# Altium schematic sheet ui_lo.SchDoc: mcHF Pro Transceiver UI board
size A3; Author: Krassi Atanassov; CompanyName: MØNKA; Engineer: For radio amateurs experimentation, non-commercial use only. Thank you!; Revision: 0.8.5; SheetTotal: 13
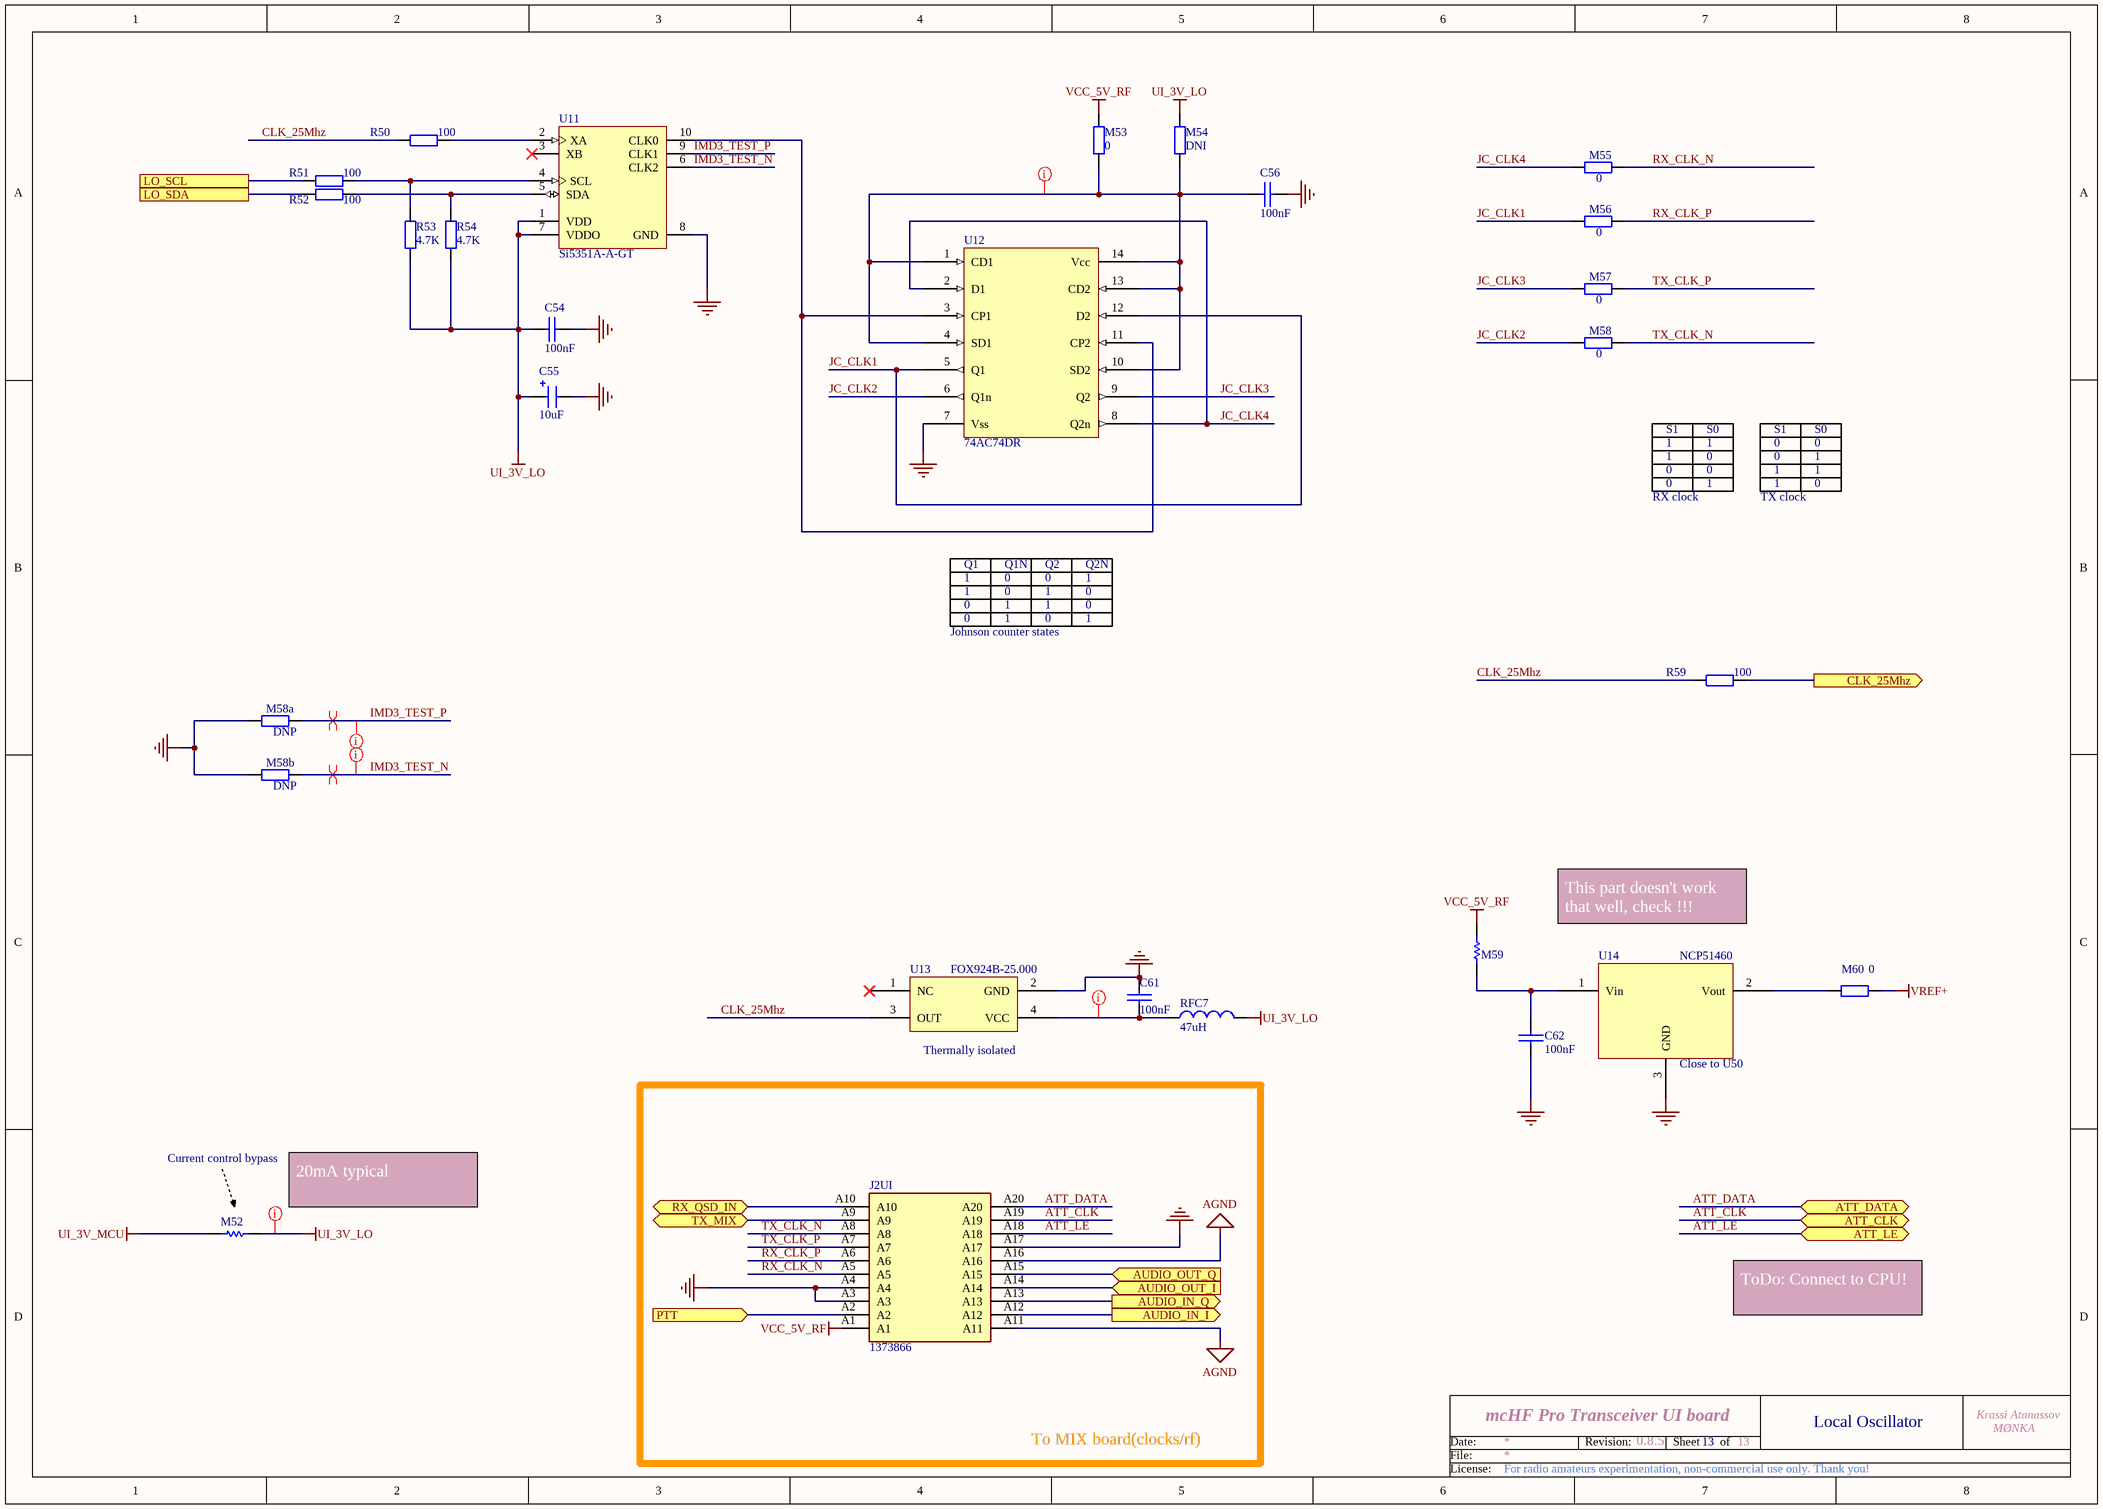
[diagram p0: ui_lo.SchDoc]

## Parts
C54  100nF  [0805]
C55  10uF  [1206_Elec_Cap]
C56  100nF  [0805]
C61  100nF  [0805]
C62  100nF  [0805]
J2UI  1373866  [YuanQi4mm]
M52  0  [SB_0603]  (value not drawn)  (net tie, no BOM)
M53  0  [0805]
M54  DNI  [0805]  (no BOM)
M55  0  [0805]
M56  0  [0805]
M57  0  [0805]
M58  0  [0805]
M58a  DNP  [0805]  (no BOM)
M58b  DNP  [0805]  (no BOM)
M59  0  [SB_0603]  (value not drawn)  (net tie, no BOM)
M60  0  [0805]
R50  100  [0805]
R51  100  [0805]
R52  100  [0805]
R53  4.7K  [0805]
R54  4.7K  [0805]
R59  100  [0805]
RFC7  47uH  [0805]
U11  Si5351A-A-GT  [SLAB-MSOP-10_N]
U12  74AC74DR  [SO-14]
U13  FOX924B-25.000  [2SMX-3SMXB]
U14  NCP51460  [SOT-23]

## Blocks framed on the sheet
To MIX board(clocks/rf): J2UI

## Ports
ATT_CLK (bidir), ATT_DATA (bidir), ATT_LE (bidir), AUDIO_IN_I (out), AUDIO_IN_Q (out), AUDIO_OUT_I (in), AUDIO_OUT_Q (in), CLK_25Mhz (out), LO_SCL, LO_SDA, PTT (in), RX_QSD_IN (bidir), TX_MIX (bidir)

## Nets
AGND: J2UI.A11 J2UI.A16
GND: C54.2 C55.2 C56.1 C61.1 C62.2 J2UI.A3 J2UI.A4 J2UI.A17 M58a.2 M58b.2 U11.8(GND) U12.7(Vss) U13.2(GND) U14.3(GND)
UI_3V_LO: C54.1 C55.1 M52.2 M54.2 R53.2 R54.2 RFC7.2 U11.1(VDD) U11.7(VDDO)
UI_3V_MCU: M52.1
VCC_5V_RF: J2UI.A1 M53.2 M59.2
VREF+: M60.1
ATT_CLK: J2UI.A19 ; port ATT_CLK
ATT_DATA: J2UI.A20 ; port ATT_DATA
ATT_LE: J2UI.A18 ; port ATT_LE
AUDIO_IN_I: J2UI.A12 ; port AUDIO_IN_I
AUDIO_IN_Q: J2UI.A13 ; port AUDIO_IN_Q
AUDIO_OUT_I: J2UI.A14 ; port AUDIO_OUT_I
AUDIO_OUT_Q: J2UI.A15 ; port AUDIO_OUT_Q
CLK_25Mhz: R50.2 R59.2 U13.3(OUT)
CLK_25Mhz: R59.1 ; port CLK_25Mhz  [a separate net that carries the same name]
IMD3_TEST_N: M58b.1 U11.6(CLK2)
IMD3_TEST_P: M58a.1 U11.9(CLK1)
JC_CLK1: M56.2 U12.5(Q1) U12.12(D2)
JC_CLK2: M58.2 U12.6(Q1n)
JC_CLK3: M57.2 U12.9(Q2)
JC_CLK4: M55.2 U12.2(D1) U12.8(Q2n)
LO_SCL: R51.2 ; port LO_SCL
LO_SDA: R52.2 ; port LO_SDA
PTT: J2UI.A2 ; port PTT
RX_CLK_N: J2UI.A5 M55.1
RX_CLK_P: J2UI.A6 M56.1
RX_QSD_IN: J2UI.A10 ; port RX_QSD_IN
TX_CLK_N: J2UI.A8 M58.1
TX_CLK_P: J2UI.A7 M57.1
TX_MIX: J2UI.A9 ; port TX_MIX
NetC56_2: C56.2 M53.1 M54.1 U12.1(CD1) U12.4(SD1) U12.10(SD2) U12.13(CD2) U12.14(Vcc)
NetC61_2: C61.2 RFC7.1 U13.4(VCC)
NetC62_1: C62.1 M59.1 U14.1(Vin)
NetM60_2: M60.2 U14.2(Vout)
NetR50_1: R50.1 U11.2(XA)
NetR51_1: R51.1 R53.1 U11.4(SCL)
NetR52_1: R52.1 R54.1 U11.5(SDA)
NetU11_10: U11.10(CLK0) U12.3(CP1) U12.11(CP2)

Not connected (* = marked no-connect by the designer): U11 3(XB)*; U13 1(NC)*

## Layout directives
rule Width Constraint [Pref Width = 12mil    Min Width = 12mil    Max Width = 12mil]: NetC56_2, NetC61_2, UI_3V_LO
differential pair: IMD3_TEST_N, IMD3_TEST_P
rule Matched Net Lengths [Tolerance = 300mil]: IMD3_TEST_N, IMD3_TEST_P

## Notes on the sheet
- S1
- 1
- S0
- 0
- RX clock
- TX clock
- Q1
- Q1N
- Q2
- Q2N
- Johnson counter states
- This part doesn't work that well, check !!!
- (near U13) Thermally isolated
- (near U14) Close to U50
- Current control bypass
- (near M52) 20mA typical
- ToDo: Connect to CPU!
- 13
- Local Oscillator
- Date:
- File:
- Revision:
- Sheet
- of
- License:

## Library data of the parts
C54 C56 C62 = CAP: Capacitor; Order: FN 252-2090; QT Order: QCC-00154; Price: 0.068
C55 = CAP-POL: Electrolitic capacitor; Order: FN 233-3009; QT Order: QCC-00166; Price: 0.204
C61 = CAP: Capacitor; Order: FN 174-0673; QT Order: QCC-00154; Price: 0.068
J2UI = YQ_20p: SMD male connector, nominal current: 2.2 A, Test voltage: 840 VAC, number of positions: 20, pitch: 1.27 mm, color: black, contact surface: Gold, type of contact: Male connector, mounting: SMD soldering; Manufacturer_Name: Phoenix Contact; Geometry.Height: 6.75mm; Mouser Part Number: 651-1373866; Mouser Price/Stock: https://www.mouser.co.uk/ProductDetail/Phoenix-Contact/1373866?qs=2SLPxufLcgAs0enIXKjUUw%3D%3D; Manufacturer_Part_Number: 1373866; Datasheet Link: http://www.phoenixcontact.com/gb/produkte/1373866
M52 M59 = Link: Value: 1K; Published: 8-Jun-2000; Revision: July-2002: Re-released for DXP Platform.; Publisher: Altium Limited
M53-M58 M58a M58b M60 = RES: Resistor; Order: FN 933-3681; QT Order: QCR-00268; Price: 0.009
R50-R52 R59 = RES: Resistor; Order: FN 933-2375; QT Order: QCR-00301; Price: 0.027
R53 R54 = RES: Resistor; Order: FN 200-8383; QT Order: QCR-00341; Price: 0.024
RFC7 = Inductor: Order: FN 166-9895; Price: 0.16
U11 = Si5351A-A-GT: I2C-Programmable Any-Frequency CMOS Clock Generator + VCXO, 2.5 / 3.3 V, 0.008 to 160 MHz Output, -40 to 85 degC, 10-pin SOP; Manufacturer: Silicon Labs; Output Format: LVCMOS; Reference Inputs: 1; VDD: 2.5 V; 3.3 V; Sub-Family: Clock Generators; Notes: Farnell had it cheap (like 80 pence); DatasheetVersion: Rev. 0.95; PackageReference: MSOP-10; PackageDescription: 10-Pin Mini Small Outline Package, Body 3 x 3 mm, Pitch 0.5 mm; Supplier 1: Digi-Key; Supplier Part Number 1: 336-1994-5-ND; Supplier 2: Mouser; Supplier Part Number 2: 634-SI5351A-A-GT; Output Frequency (MHz): 0.008 to 160; Mounting Technology: Surface Mount; Code_JEDEC: MO-187; Code_IPC: J-STD-020; PartNumber: Si5351A-A-GT; ComponentLink1Description: Manufacturer URL; ComponentLink1URL: http://www.silabs.com/; ComponentLink2Description: Datasheet; ComponentLink2URL: http://www.silabs.com/Support%20Documents/TechnicalDocs/Si5351.pdf; ComponentLink3Description: Package Specification; ComponentLink3URL: http://www.silabs.com/Support Documents/TechnicalDocs/C8051T60x.pdf
U12 = 74LCX74M: Low Voltage Dual D-Type Positive Edge-Triggered  Flip-Flop with 5V Tolerant Inputs; Order: FN 985-3502; QT Order: QCI-00713; Notes: Can use PO74G74A, but remove M52, install M53; Price: 0.23
U13 = FOX924B-16.000: TCXO; Order: FN 206-3959; Price: 2.77
U14 = NCP51460: 3.3V voltage reference, SOT-23